# Altium schematic sheet LED_Driver - 1.SchDoc
size A3
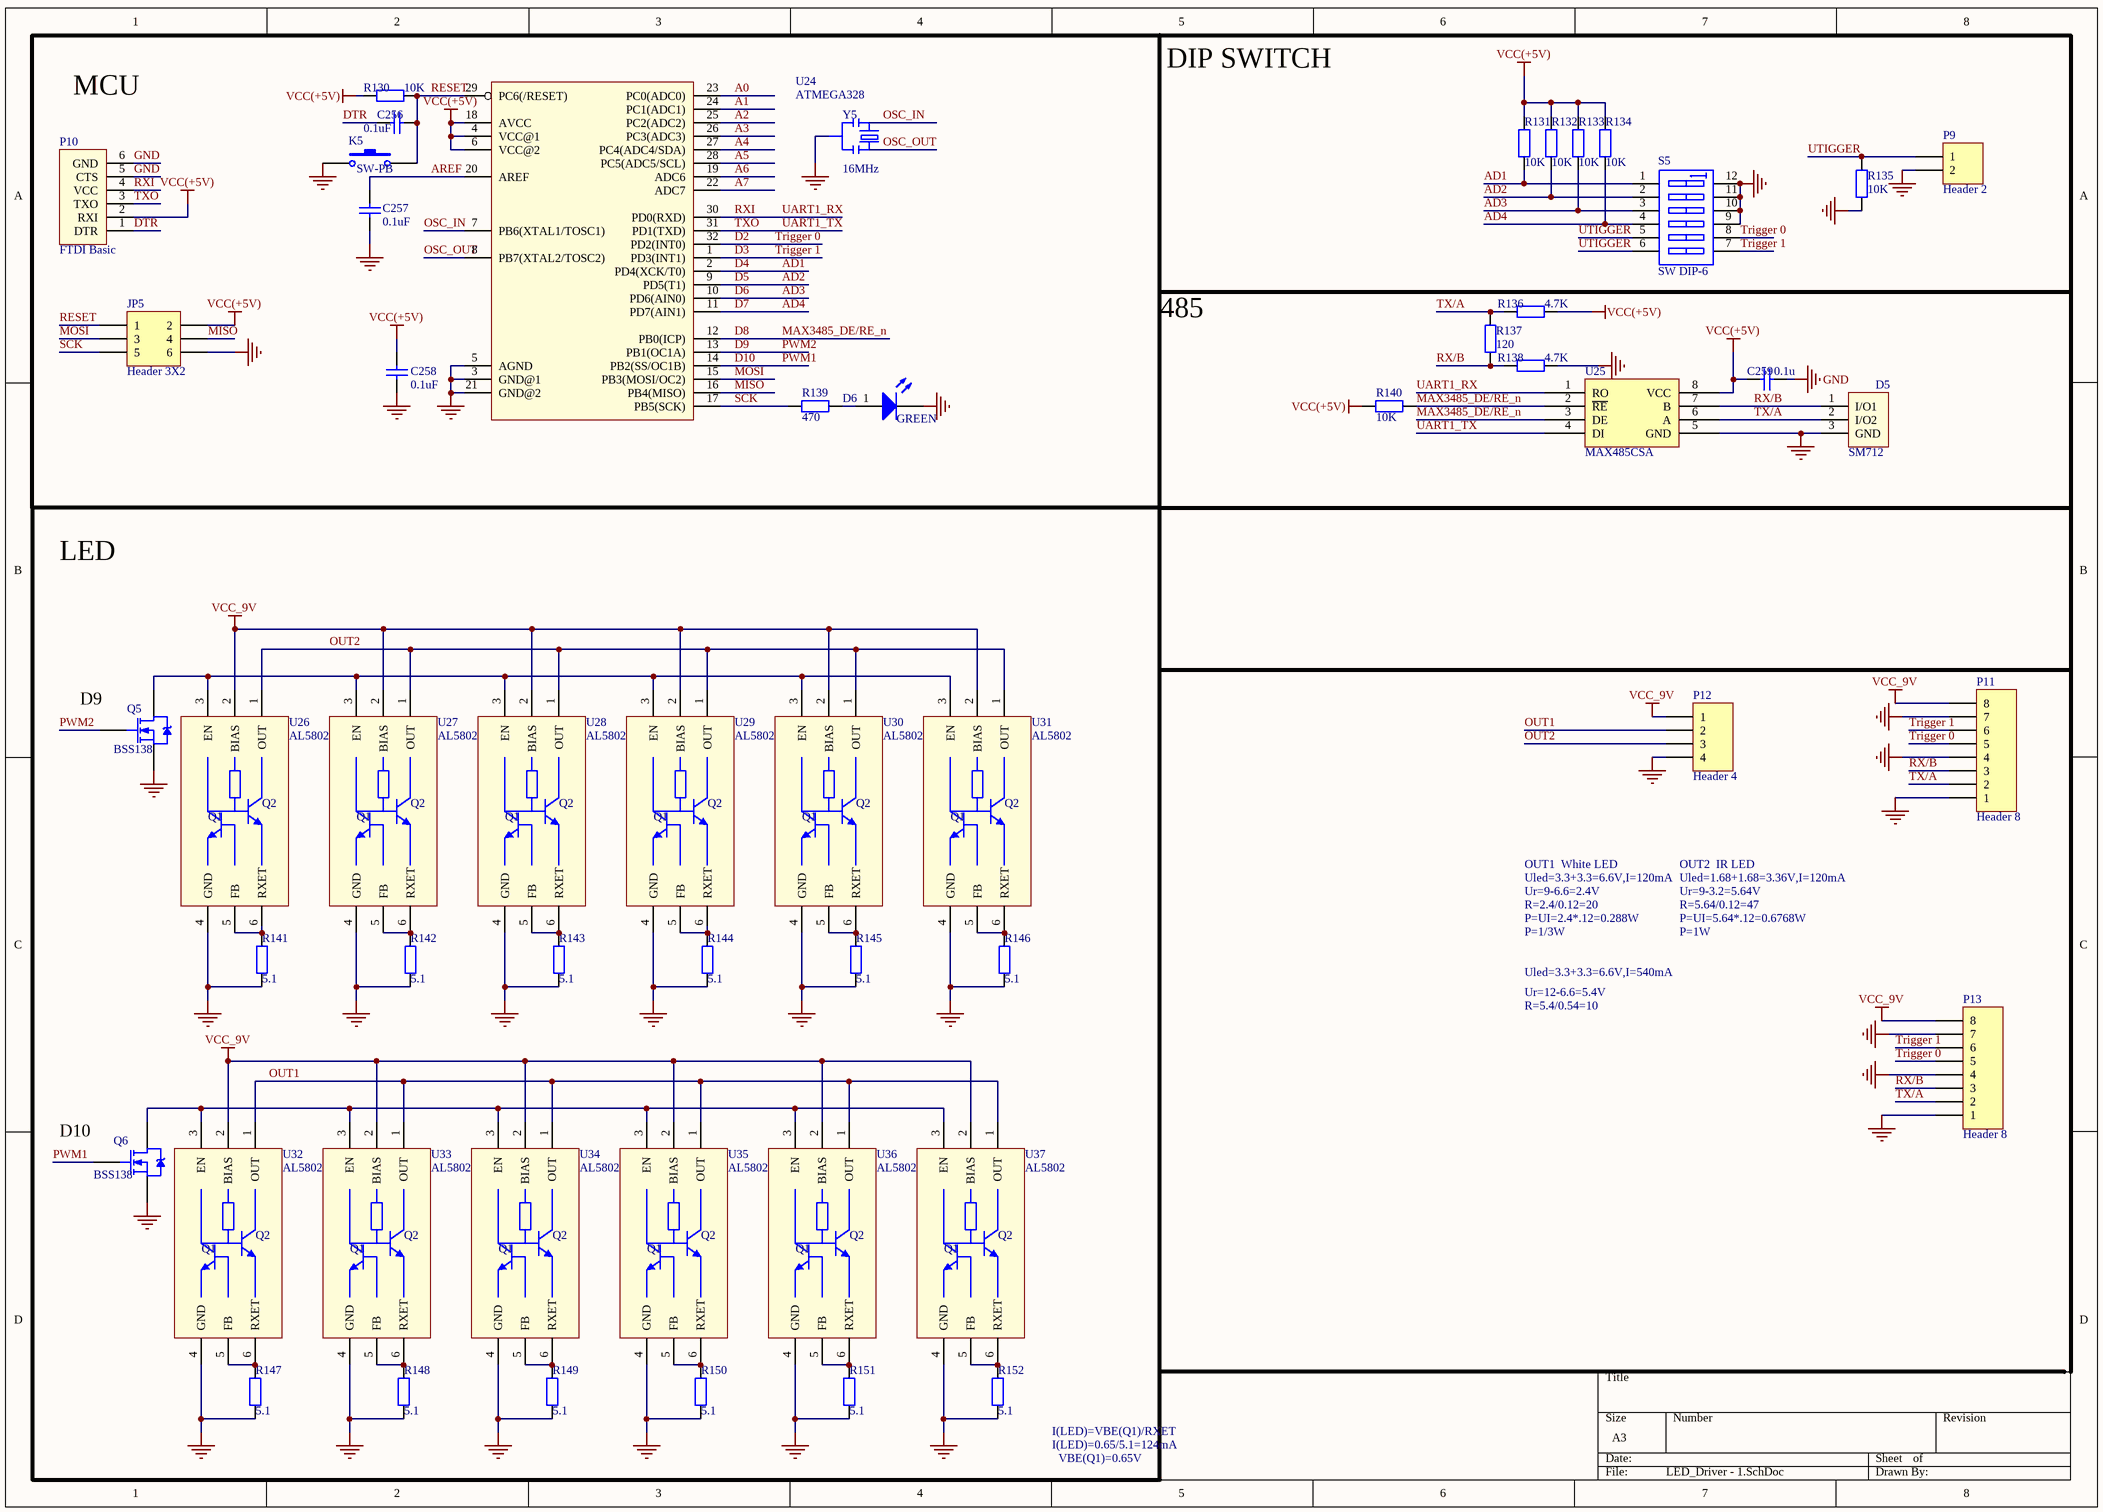
[diagram p0: LED_Driver - 1.SchDoc]

## Parts
C256  0.1uF  [C0603]
C257  0.1uF  [C0603]
C258  0.1uF  [C0603]
C259  0.1u  [C0603]
D5  SM712  [SOT23-3]
D6  GREEN  [LED0805]
JP5  Header 3X2  [MHDR1X6]
K5  SW-PB  [157SW]
P9  Header 2  [HDR1X2]
P10  FTDI Basic  [MHDR1X6]
P11  Header 8  [SH_1.25MM*8]
P12  Header 4  [SMT_1.25MM*4]
P13  Header 8  [SH_1.25MM*8]
Q5  BSS138  [SOT-23 (Standard)]
Q6  BSS138  [SOT-23 (Standard)]
R130  10K  [R0603]
R131  10K  [R0603]
R132  10K  [R0603]
R133  10K  [R0603]
R134  10K  [R0603]
R135  10K  [R0603]
R136  4.7K  [R0603]
R137  120  [R0603]
R138  4.7K  [R0603]
R139  470  [R0603]
R140  10K  [R0603]
R141  5.1  [R0603]
R142  5.1  [R0603]
R143  5.1  [R0603]
R144  5.1  [R0603]
R145  5.1  [R0603]
R146  5.1  [R0603]
R147  5.1  [R0603]
R148  5.1  [R0603]
R149  5.1  [R0603]
R150  5.1  [R0603]
R151  5.1  [R0603]
R152  5.1  [R0603]
S5  SW DIP-6  [DIP_SW_6WAY_SMD]
U24  ATMEGA328  [TQFP32-08]
U25  MAX485CSA  [SOIC-8]
U26  AL5802  [SOT26]
U27  AL5802  [SOT26]
U28  AL5802  [SOT26]
U29  AL5802  [SOT26]
U30  AL5802  [SOT26]
U31  AL5802  [SOT26]
U32  AL5802  [SOT26]
U33  AL5802  [SOT26]
U34  AL5802  [SOT26]
U35  AL5802  [SOT26]
U36  AL5802  [SOT26]
U37  AL5802  [SOT26]
Y5  16MHz  [RESONATOR-SMD]

## Blocks framed on the sheet
LED: Q5 Q6 R141-R152 U26-U37

## Nets
GND: C257.1 C258.2 C259.1 D5.3(GND) D6.2(K) JP5.6 K5.1 P9.2 P10.5(CTS) P10.6(GND) P11.1 P11.4 P11.7 P12.4 P13.1 P13.4 P13.7 Q5.S Q6.S R135.1 R138.1 R141.2 R142.2 R143.2 R144.2 R145.2 R146.2 R147.2 R148.2 R149.2 R150.2 R151.2 R152.2 S5.9(B4) S5.10(B3) S5.11(B2) S5.12(B1) U24.3(GND@1) U24.5(AGND) U24.21(GND@2) U25.5(GND) U26.4(GND) U27.4(GND) U28.4(GND) U29.4(GND) U30.4(GND) U31.4(GND) U32.4(GND) U33.4(GND) U34.4(GND) U35.4(GND) U36.4(GND) U37.4(GND) Y5.2
VCC(+5V): C258.1 C259.2 JP5.2 P10.2(RXI) R130.1 R131.1 R132.1 R133.1 R134.1 R136.1 R140.2 U24.4(VCC@1) U24.6(VCC@2) U24.18(AVCC) U25.8(VCC)
VCC_9V: P11.8 P12.1 P13.8 U26.2(BIAS) U27.2(BIAS) U28.2(BIAS) U29.2(BIAS) U30.2(BIAS) U31.2(BIAS) U32.2(BIAS) U33.2(BIAS) U34.2(BIAS) U35.2(BIAS) U36.2(BIAS) U37.2(BIAS)
A0: U24.23(PC0(ADC0))
A1: U24.24(PC1(ADC1))
A2: U24.25(PC2(ADC2))
A3: U24.26(PC3(ADC3))
A4: U24.27(PC4(ADC4/SDA))
A5: U24.28(PC5(ADC5/SCL))
A6: U24.19(ADC6)
A7: U24.22(ADC7)
AD1: R131.2 S5.1(A1) U24.2(PD4(XCK/T0))  [also labelled D4]
AD2: R132.2 S5.2(A2) U24.9(PD5(T1))  [also labelled D5]
AD3: R133.2 S5.3(A3) U24.10(PD6(AIN0))  [also labelled D6]
AD4: R134.2 S5.4(A4) U24.11(PD7(AIN1))  [also labelled D7]
AREF: C257.2 U24.20(AREF)
D2: P11.5 P13.5 S5.8(B5) U24.32(PD2(INT0))  [also labelled Trigger 0]
D3: P11.6 P13.6 S5.7(B6) U24.1(PD3(INT1))  [also labelled Trigger 1]
D8: R140.1 U24.12(PB0(ICP)) U25.2(~{RE}) U25.3(DE)  [also labelled MAX3485_DE/RE_n]
D9: Q5.G U24.13(PB1(OC1A))  [also labelled PWM2]
D10: Q6.G U24.14(PB2(SS/OC1B))  [also labelled PWM1]
DTR: C256.1 P10.1(DTR)
MISO: JP5.4 U24.16(PB4(MISO))
MOSI: JP5.3 U24.15(PB3(MOSI/OC2))
OSC_IN: U24.7(PB6(XTAL1/TOSC1)) Y5.3
OSC_OUT: U24.8(PB7(XTAL2/TOSC2)) Y5.1
OUT1: P12.2 U32.1(OUT) U33.1(OUT) U34.1(OUT) U35.1(OUT) U36.1(OUT) U37.1(OUT)
OUT2: P12.3 U26.1(OUT) U27.1(OUT) U28.1(OUT) U29.1(OUT) U30.1(OUT) U31.1(OUT)
RESET: C256.2 JP5.1 K5.2 R130.2 U24.29(PC6(/RESET))
RX/B: D5.1(I/O1) P11.3 P13.3 R137.2 R138.2 U25.7(B)
RXI: P10.4(VCC) U24.30(PD0(RXD)) U25.1(RO)  [also labelled UART1_RX]
SCK: JP5.5 R139.1 U24.17(PB5(SCK))
TX/A: D5.2(I/O2) P11.2 P13.2 R136.2 R137.1 U25.6(A)
TXO: P10.3(TXO) U24.31(PD1(TXD)) U25.4(DI)  [also labelled UART1_TX]
UTIGGER: P9.1 R135.2 S5.5(A5) S5.6(A6)
NetD6_1: D6.1(A) R139.2
NetQ5_D: Q5.D U26.3(EN) U27.3(EN) U28.3(EN) U29.3(EN) U30.3(EN) U31.3(EN)
NetQ6_D: Q6.D U32.3(EN) U33.3(EN) U34.3(EN) U35.3(EN) U36.3(EN) U37.3(EN)
NetR141_1: R141.1 U26.5(FB) U26.6(RXET)
NetR142_1: R142.1 U27.5(FB) U27.6(RXET)
NetR143_1: R143.1 U28.5(FB) U28.6(RXET)
NetR144_1: R144.1 U29.5(FB) U29.6(RXET)
NetR145_1: R145.1 U30.5(FB) U30.6(RXET)
NetR146_1: R146.1 U31.5(FB) U31.6(RXET)
NetR147_1: R147.1 U32.5(FB) U32.6(RXET)
NetR148_1: R148.1 U33.5(FB) U33.6(RXET)
NetR149_1: R149.1 U34.5(FB) U34.6(RXET)
NetR150_1: R150.1 U35.5(FB) U35.6(RXET)
NetR151_1: R151.1 U36.5(FB) U36.6(RXET)
NetR152_1: R152.1 U37.5(FB) U37.6(RXET)

## Notes on the sheet
- MCU
- DIP SWITCH
- 485
- (near Q5) D9
- Uled=3.3+3.3=6.6V,I=120mA
- OUT1  White LED
- R=2.4/0.12=20
- P=UI=2.4*.12=0.288W
- Ur=9-6.6=2.4V
- Uled=1.68+1.68=3.36V,I=120mA
- OUT2  IR LED
- R=5.64/0.12=47
- P=UI=5.64*.12=0.6768W
- Ur=9-3.2=5.64V
- P=1/3W
- Uled=3.3+3.3=6.6V,I=540mA
- Ur=12-6.6=5.4V
- P=1W
- R=5.4/0.54=10
- (near Q6) D10
- I(LED)=VBE(Q1)/RXET
- I(LED)=0.65/5.1=124mA
- VBE(Q1)=0.65V
- (in symbol AL5802) Q2; Q1

## Library data of the parts
C256-C258 = CAP SMT C100nF25V10%X7R: Capacitor; Voltage: 25V; iPartNumber: C100nF25V10%X7R; Value: 0.1uF
C259 = Cap: Capacitor; Value: 100pF; Published: 8-Jun-2000; LatestRevisionDate: 17-Jul-2002; LatestRevisionNote: Re-released for DXP Platform.; PackageReference: RAD-0.3; Publisher: Altium Limited
D6 = LED0: Typical INFRARED GaAs LED; Published: 8-Jun-2000; LatestRevisionDate: 08-Jul-2005; LatestRevisionNote: Mech Layer 1 removed.; PackageReference: LED-0; Publisher: Altium Limited
JP5 = Header 3X2: Header, 3-Pin, Dual row; LatestRevisionDate: 17-Jul-2002; LatestRevisionNote: Re-released for DXP Platform.; Publisher: Altium Limited
K5 = SW-PB: Switch; Published: 24-Mar-1999; LatestRevisionDate: 17-Jul-2002; LatestRevisionNote: Re-released for DXP Platform.; PackageReference: SPST-2; Publisher: Altium Limited; PackageDescription: Switch; 2 Leads
P9 = Header 2: Header, 2-Pin; LatestRevisionDate: 17-Jul-2002; LatestRevisionNote: Re-released for DXP Platform.; Publisher: Altium Limited
P10 = ARDUINO_SERIAL_PROGRAMPTH
P11 P13 = Header 8: Header, 8-Pin; LatestRevisionDate: 17-Jul-2002; LatestRevisionNote: Re-released for DXP Platform.; Publisher: Altium Limited
P12 = Header 4: Header, 4-Pin; LatestRevisionDate: 17-Jul-2002; LatestRevisionNote: Re-released for DXP Platform.; Publisher: Altium Limited
Q5 Q6 = NMOS: Manufacturer: Fairchild Semiconductor; Manufacturer Part Number: BSS123; FET Type: MOSFET N-Channel, Metal Oxide; FET Feature: Logic Level Gate; Drain to Source Voltage (Vdss): 100V; Current - Continuous Drain (Id) @ 25°C: 170mA (Ta); Rds On (Max) @ Id, Vgs: 6 Ohm @ 170mA, 10V; Vgs(th) (Max) @ Id: 2V @ 1mA; Gate Charge (Qg) @ Vgs: 2.5nC @ 10V; Input Capacitance (Ciss) @ Vds: 73pF @ 25V; Power - Max: 360mW; Supplier 1: Digi-Key; Supplier Part Number 1: BSS123NCT-ND; RoHS: RoHS Compliant; Category: Discrete Semiconductor Products; Stock 1: 163946; Pricing 1: 1=0.24, 10=0.216, 25=0.1556, 100=0.1211, 250=0.07612, 500=0.06484, 1000=0.04418 (USD); Packaging: Cut Tape (CT); Mounting Type: Surface Mount; Package / Case: TO-236-3, SC-59, SOT-23-3; Supplier Device Package: SOT-23; ComponentLink1URL: http://www.fairchildsemi.com/datasheets/BS/BSS123.pdf; ComponentLink1Description: http://www.fairchildsemi.com/datasheets/BS/BSS123.pdf
R130-R134 R136-R152 = Res2: Resistor
R135 = Res2: Resistor; Value: 1k; Published: 8-Jun-2000; LatestRevisionDate: 17-Jul-2002; LatestRevisionNote: Re-released for DXP Platform.; PackageReference: AXIAL-0.4; Publisher: Altium Limited
S5 = SW DIP-6: DIP Switch, 6 Position, SPST; Published: 24-Mar-1999; LatestRevisionDate: 17-Jul-2002; LatestRevisionNote: Re-released for DXP Platform.; PackageReference: DIP-12/SW; Publisher: Altium Limited
U24 = ATMEGA168
U25 = MAX3485CSA
Y5 = RESONATORSMD